# EAGLE design Current measurement circuit (EAGLE 9.6.2)
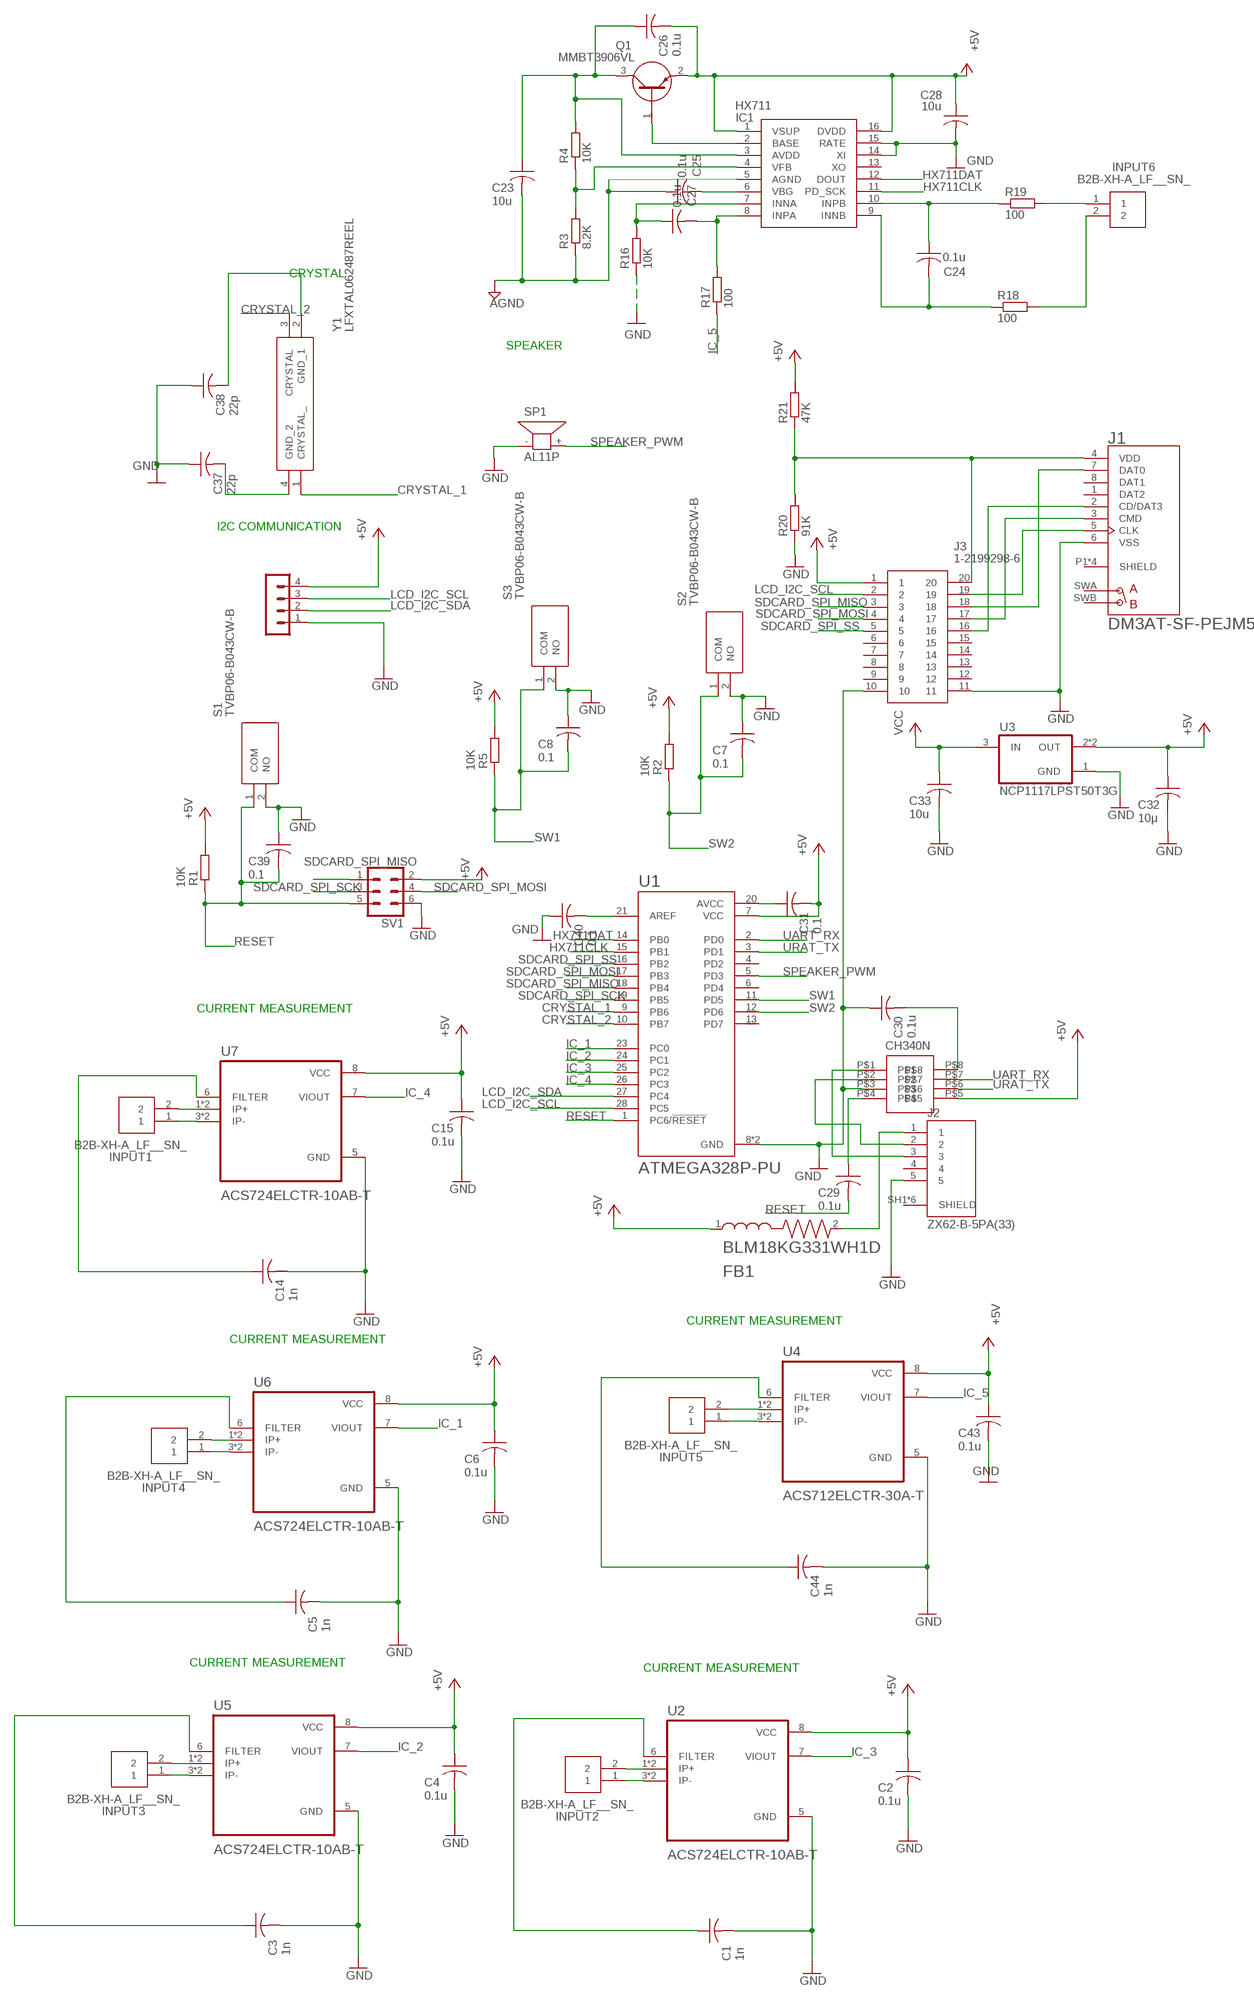
[diagram p0: schematic, sheet 1]

## Parts
C1  1n  C-USC1608  [C1608]
C2  0.1u  C-USC1608  [C1608]
C3  1n  C-USC1608  [C1608]
C4  0.1u  C-USC1608  [C1608]
C5  1n  C-USC1608  [C1608]
C6  0.1u  C-USC1608  [C1608]
C7  0.1  C-USC1608  [C1608]
C8  0.1  C-USC1608  [C1608]
C14  1n  C-USC1608  [C1608]
C15  0.1u  C-USC1608  [C1608]
C23  10u  C-USC1608  [C1608]
C24  0.1u  C-USC1608  [C1608]
C25  0.1u  C-USC1608  [C1608]
C26  0.1u  C-USC1608  [C1608]
C27  0.1u  C-USC1608  [C1608]
C28  10u  C-USC1608  [C1608]
C29  0.1u  C-USC1608  [C1608]
C30  0.1u  C-USC1608  [C1608]
C31  0.1  C-USC1608  [C1608]
C32  10μ  C-USC1608  [C1608]
C33  10u  C-USC1608  [C1608]
C37  22p  C-USC1608  [C1608]
C38  22p  C-USC1608  [C1608]
C39  0.1  C-USC1608  [C1608]
C40  0.1  C-USC1608  [C1608]
C43  0.1u  C-USC1608  [C1608]
C44  1n  C-USC1608  [C1608]
FB1  BLM18KG331WH1D  [BEADC1608X75N]
IC1  HX711  [SOIC127P600X160-16N]
INPUT1  B2B-XH-A_LF__SN_  [SHDR2W64P0X250_1X2_740X575X700]
INPUT2  B2B-XH-A_LF__SN_  [SHDR2W64P0X250_1X2_740X575X700]
INPUT3  B2B-XH-A_LF__SN_  [SHDR2W64P0X250_1X2_740X575X700]
INPUT4  B2B-XH-A_LF__SN_  [SHDR2W64P0X250_1X2_740X575X700]
INPUT5  B2B-XH-A_LF__SN_  [SHDR2W64P0X250_1X2_740X575X700]
INPUT6  B2B-XH-A_LF__SN_  [SHDR2W64P0X250_1X2_740X575X700]
J1  DM3AT-SF-PEJM5  [HRS_DM3AT-SF-PEJM5]
J2  ZX62-B-5PA(33)  [HRS_ZX62-B-5PA(33)]
J3  1-2199298-6  [DIPS762W70P254L2540H510Q20N]
Q1  MMBT3906VL  [SOT95P230X110-3N]
R1  10K  R-EU_R0603  [R0603]
R2  10K  R-EU_R0603  [R0603]
R3  8.2K  R-EU_R0603  [R0603]
R4  10K  R-EU_R0603  [R0603]
R5  10K  R-EU_R0603  [R0603]
R16  10K  R-EU_R0603  [R0603]
R17  100  R-EU_R0603  [R0603]
R18  100  R-EU_R0603  [R0603]
R19  100  R-EU_R0603  [R0603]
R20  91K  R-EU_R0603  [R0603]
R21  47K  R-EU_R0603  [R0603]
S1  TVBP06-B043CW-B  [TVBP06B043CWB]
S2  TVBP06-B043CW-B  [TVBP06B043CWB]
S3  TVBP06-B043CW-B  [TVBP06B043CWB]
SP1  AL11P  [AL11P]
SV1  MA03-2  [MA03-2]
SV4  MA04-1  [MA04-1]
U1  ATMEGA328P-PU  [DIP794W46P254L2967H457Q28B]
U2  ACS724ELCTR-10AB-T  [SOIC127P600X175-8N]
U3  NCP1117LPST50T3G  [SOT230P700X180-4N]
U4  ACS712ELCTR-30A-T  [SOIC127P600X175-8N]
U5  ACS724ELCTR-10AB-T  [SOIC127P600X175-8N]
U6  ACS724ELCTR-10AB-T  [SOIC127P600X175-8N]
U7  ACS724ELCTR-10AB-T  [SOIC127P600X175-8N]
U$1  CH340N  [CH340N]
Y1  LFXTAL062487REEL  [LFXTAL062487REEL]

## Nets
+5V [PW]: C2.1 C4.1 C6.1 C15.1 C26.2 C28.1 C31.2 C32.1 C43.1 FB1.1 IC1.1(VSUP) IC1.16(DVDD) J3.1 Q1.2(E) R1.2 R2.2 R5.2 R21.2 SV1.2 SV4.4 U1.7(VCC) U2.8(VCC) U3.2(OUT) U3.4(OUT) U4.8(VCC) U5.8(VCC) U6.8(VCC) U7.8(VCC) U$1.P$5
AGND [GND]: C23.2 C25.1 IC1.5(AGND) R3.1
CRYSTAL_1: U1.9(PB6) Y1.1(CRYSTAL_)
CRYSTAL_2: U1.10(PB7) Y1.3(CRYSTAL)
GND [GND]: C1.2 C2.2 C3.2 C4.2 C5.2 C6.2 C7.1 C8.1 C14.2 C15.2 C28.2 C30.1 C32.2 C33.2 C37.1 C38.1 C39.1 C40.1 C43.2 C44.2 IC1.14(XI) IC1.15(RATE) J1.6(VSS) J2.5 J3.10 J3.11 R16.1 R20.1 S1.2(NO) S2.2(NO) S3.2(NO) SP1.- SV1.6 SV4.1 U1.8(GND) U1.22(GND) U2.5(GND) U3.1(GND) U4.5(GND) U5.5(GND) U6.5(GND) U7.5(GND) U$1.P$3
HX711CLK: IC1.11(PD_SCK) U1.15(PB1)
HX711DAT: IC1.12(DOUT) U1.14(PB0)
IC_1: U1.23(PC0) U6.7(VIOUT)
IC_2: U1.24(PC1) U5.7(VIOUT)
IC_3: U1.25(PC2) U2.7(VIOUT)
IC_4: U1.26(PC3) U7.7(VIOUT)
IC_5: R17.1 U4.7(VIOUT)
LCD_I2C_SCL: J3.2 SV4.3 U1.28(PC5)
LCD_I2C_SDA: SV4.2 U1.27(PC4)
N$1: C29.1 U$1.P$4
N$2: C37.2 Y1.4(GND_2)
N$3: C38.2 Y1.2(GND_1)
N$4: C1.1 U2.6(FILTER)
N$5: C3.1 U5.6(FILTER)
N$7: C40.2 U1.21(AREF)
N$8: C31.1 U1.20(AVCC)
N$9 [Deta]: INPUT5.2 U4.1(IP+) U4.2(IP+)
N$10 [Deta]: INPUT5.1 U4.3(IP-) U4.4(IP-)
N$11: C44.1 U4.6(FILTER)
N$12 [Deta]: INPUT2.2 U2.1(IP+) U2.2(IP+)
N$13 [Deta]: INPUT2.1 U2.3(IP-) U2.4(IP-)
N$14: C5.1 U6.6(FILTER)
N$17 [Deta]: INPUT3.2 U5.1(IP+) U5.2(IP+)
N$18 [Deta]: INPUT3.1 U5.3(IP-) U5.4(IP-)
N$20 [Deta]: INPUT1.2 U7.1(IP+) U7.2(IP+)
N$21 [Deta]: INPUT1.1 U7.3(IP-) U7.4(IP-)
N$22: C14.1 U7.6(FILTER)
N$23: C27.1 IC1.7(INNA) R16.2
N$24: C27.2 IC1.8(INPA) R17.2
N$25: IC1.2(BASE) Q1.1(B)
N$26: C25.2 IC1.6(VBG)
N$27: C23.1 C26.1 IC1.3(AVDD) Q1.3(C) R4.2
N$29: INPUT6.1 R19.2
N$30: J1.2(CD/DAT3) J3.16
N$32: J1.3(CMD) J3.17
N$33: J1.5(CLK) J3.19
N$34: IC1.4(VFB) R3.2 R4.1
N$35: J1.7(DAT0) J3.18
N$36: J2.3 U$1.P$1
N$37: C24.1 IC1.10(INPB) R19.1
N$38: C30.2 U$1.P$8
N$39: INPUT6.2 R18.2
N$40: C24.2 IC1.9(INNB) R18.1
N$42: J2.2 U$1.P$2
N$44: FB1.2 J2.1
N$45: J1.4(VDD) J3.20 R20.2 R21.1
N$50 [Deta]: INPUT4.2 U6.1(IP+) U6.2(IP+)
N$51 [Deta]: INPUT4.1 U6.3(IP-) U6.4(IP-)
RESET: C29.2 C39.2 R1.1 S1.1(COM) SV1.5 U1.1(PC6/!RESET)
SDCARD_SPI_MISO: J3.3 SV1.1 U1.18(PB4)
SDCARD_SPI_MOSI: J3.4 SV1.4 U1.17(PB3)
SDCARD_SPI_SCK: SV1.3 U1.19(PB5)
SDCARD_SPI_SS: J3.5 U1.16(PB2)
SPEAKER_PWM: SP1.+ U1.5(PD3)
SW1: C8.2 R5.1 S3.1(COM) U1.11(PD5)
SW2: C7.2 R2.1 S2.1(COM) U1.12(PD6)
UART_RX: U1.2(PD0) U$1.P$7
URAT_TX: U1.3(PD1) U$1.P$6
VCC [PW]: C33.1 U3.3(IN)
Unconnected: IC1.13(XO) J1.1(DAT2) J1.8(DAT1) J1.P1(SHIELD) J1.P2(SHIELD) J1.P3(SHIELD) J1.P4(SHIELD) J1.SWA(A) J1.SWB(B) J2.4 J2.SH1(SHIELD) J2.SH2(SHIELD) J2.SH3(SHIELD) J2.SH4(SHIELD) J2.SH5(SHIELD) J2.SH6(SHIELD) J3.6 J3.7 J3.8 J3.9 J3.12 J3.13 J3.14 J3.15 U1.4(PD2) U1.6(PD4) U1.13(PD7)

## Notes on the sheet
- CRYSTAL
- SPEAKER
- I2C COMMUNICATION
- CURRENT MEASUREMENT
- CURRENT MEASUREMENT
- CURRENT MEASUREMENT
- CURRENT MEASUREMENT
- CURRENT MEASUREMENT

## Library data of the parts
C1-C8 C14 C15 C23-C33 C37-C40 C43 C44 = rcl:C-US: CAPACITOR, American symbol; SPICEPREFIX: C
FB1 = BLM18KG331WH1D:BLM18KG331WH1D: 100 Ohms @ 100MHz 1 Power Line Ferrite Bead 0603 (1608 Metric) 1.5A 55mOhm Check prices <https://pricing.snapeda.com/parts/BLM18KG331WH1D/Murata/view-part?ref=eda>; AVAILABILITY: In Stock; DESCRIPTION: 330 Ohms @ 100MHz 1 Power Line Ferrite Bead 0603 (1608 Metric) 1.25A 110mOhm; MF: Murata; MP: BLM18KG331WH1D; PACKAGE: 0603 Murata; PRICE: None; PURCHASE-URL: https://pricing.snapeda.com/search/part/BLM18KG331WH1D/?ref=eda
IC1 = SamacSys_Parts:HX711: 24-Bit Analog-to-Digital Converter (ADC) for Weigh Scales Source: Datasheet <https://cdn.sparkfun.com/datasheets/Sensors/ForceFlex/hx711_english.pdf>; DESCRIPTION: 24-Bit Analog-to-Digital Converter (ADC) for Weigh Scales; HEIGHT: 1.6mm; MANUFACTURER_NAME: DFRobot; MANUFACTURER_PART_NUMBER: HX711
INPUT1-INPUT6 = SamacSys_Parts:B2B-XH-A_LF__SN_: Connector Header Through Hole 2 position 0.098" (2.50mm) Source: Datasheet <http://www.jst-mfg.com/product/pdf/eng/eXH.pdf>; DESCRIPTION: Connector Header Through Hole 2 position 0.098" (2.50mm); HEIGHT: 7mm; MANUFACTURER_NAME: JST (JAPAN SOLDERLESS TERMINALS); MANUFACTURER_PART_NUMBER: B2B-XH-A(LF)(SN)
J1 = DM3AT-SF-PEJM5:DM3AT-SF-PEJM5: DM3 Series 8 Position Right Angle SMT Push Push Ejection MicroSD Card Connector Check prices <https://pricing.snapeda.com/parts/DM3AT-SF-PEJM5/Hirose/view-part?ref=eda>; AVAILABILITY: In Stock; DESCRIPTION: 10 (8 + 2) Position Card Connector Secure Digital - microSD™ Surface Mount, Right Angle Gold; MF: Hirose; MP: DM3AT-SF-PEJM5; PACKAGE: None; PRICE: None; PURCHASE-URL: https://pricing.snapeda.com/search/part/DM3AT-SF-PEJM5/?ref=eda
J2 = ZX62-B-5PA_33_:ZX62-B-5PA(33): ZX Series 5 Position Right Angle PCB Wire Micro B USB Plug Check prices <https://pricing.snapeda.com/parts/ZX62-B-5PA%2833%29/Hirose/view-part?ref=eda>; AVAILABILITY: In Stock; DESCRIPTION: USB - micro B USB 2.0 Receptacle Connector 5 Position Surface Mount, Right Angle; MF: Hirose; MP: ZX62-B-5PA(33); PACKAGE: None; PRICE: None; PURCHASE-URL: https://pricing.snapeda.com/search/part/ZX62-B-5PA(33)/?ref=eda
J3 = SamacSys_Parts:1-2199298-6: TE Connectivity 2.54mm Pitch Straight 20 Way, Through Hole Ladder IC Dip Socket, 1A Source: Datasheet <https://www.te.com/commerce/DocumentDelivery/DDEController?Action=showdoc&DocId=Customer Drawing2199298ApdfEnglishENG_CD_2199298_A_baseFilename.pdf1-2199298-6>; DESCRIPTION: TE Connectivity 2.54mm Pitch Straight 20 Way, Through Hole Ladder IC Dip Socket, 1A; HEIGHT: 5.1mm; MANUFACTURER_NAME: TE Connectivity; MANUFACTURER_PART_NUMBER: 1-2199298-6; MOUSER_PART_NUMBER: 571-1-2199298-6; MOUSER_PRICE-STOCK: https://www.mouser.co.uk/ProductDetail/TE-Connectivity/1-2199298-6?qs=fK8dlpkaUMvuMXpJTs4GlA%3D%3D
Q1 = SamacSys_Parts:MMBT3906VL: MMBT3906 - PNP switching transistor Source: Datasheet <http://assets.nexperia.com/documents/data-sheet/MMBT3906.pdf>; DESCRIPTION: MMBT3906 - PNP switching transistor; HEIGHT: 1.1mm; MANUFACTURER_NAME: Nexperia; MANUFACTURER_PART_NUMBER: MMBT3906VL; MOUSER_PART_NUMBER: 771-MMBT3906VL; MOUSER_PRICE-STOCK: https://www.mouser.co.uk/ProductDetail/Nexperia/MMBT3906VL?qs=cnAQGvEIVkImZI4SlBypMg%3D%3D
R1-R5 R16-R21 = rcl:R-EU_: RESISTOR, European symbol; SPICEPREFIX: R
S1-S3 = SamacSys_Parts:TVBP06-B043CW-B: Tactile Switch Source: Datasheet <http://akizukidenshi.com/download/ds/jianfu/TVBP06-BN043CW-B.pdf>; DESCRIPTION: Tactile Switch; HEIGHT: 4.4mm; MANUFACTURER_NAME: Zhejiang Jianfu Electronics Co., Ltd; MANUFACTURER_PART_NUMBER: TVBP06-B043CW-B
SP1 = buzzer:AL11P: SPEAKER Source: Buerklin; OC_FARNELL: unknown; OC_NEWARK: unknown
SV1 = con-lstb:MA03-2: PIN HEADER; OC_FARNELL: unknown; OC_NEWARK: unknown
SV4 = con-lstb:MA04-1: PIN HEADER; OC_FARNELL: unknown; OC_NEWARK: unknown
U1 = ATMEGA328P-PU:ATMEGA328P-PU: ATmega Series 20 MHz 32 KB Flash 2 KB SRAM 8-Bit Microcontroller - DIP-28 Check prices <https://pricing.snapeda.com/parts/ATMEGA328P-PU/Microchip%20Technology/view-part?ref=eda>; AVAILABILITY: In Stock; DESCRIPTION: AVR AVR® ATmega Microcontroller IC 8-Bit 20MHz 32KB (16K x 16) FLASH 28-PDIP; MF: Microchip Technology; MP: ATMEGA328P-PU; PACKAGE: DIP-28 Microchip Technology; PRICE: None; PURCHASE-URL: https://pricing.snapeda.com/search/part/ATMEGA328P-PU/?ref=eda
U2 U5-U7 = ACS724ELCTR-10AB-T:ACS724ELCTR-10AB-T: Check prices <https://pricing.snapeda.com/parts/ACS712ELCTR-05B-T/Allegro/view-part?ref=eda>; AVAILABILITY: In Stock; DESCRIPTION: Current Sensor 5A 1 Channel Hall Effect, Open Loop Bidirectional 8-SOIC (0.154, 3.90mm Width); MF: Allegro; MP: ACS712ELCTR-05B-T; PACKAGE: SOIC-8 Allegro MicroSystems LLC; PRICE: None
U3 = NCP1117LPST50T3G:NCP1117LPST50T3G: Linear Voltage Regulator, Positive, LDO, 1.0 A (Fixed and Adjustable) Vout: 5.0 V Check prices <https://pricing.snapeda.com/parts/NCP1117LPST50T3G/ON%20Semiconductor/view-part?ref=eda>; AVAILABILITY: In Stock; DESCRIPTION: Linear Voltage Regulator IC Positive Fixed 1 Output 1A SOT-223; MF: ON Semiconductor; MP: NCP1117LPST50T3G; PACKAGE: SOT-223-4 ON Semiconductor; PRICE: None; PURCHASE-URL: https://pricing.snapeda.com/search/part/NCP1117LPST50T3G/?ref=eda
U4 = ACS712ELCTR-30A-T:ACS712ELCTR-30A-T: Check prices <https://pricing.snapeda.com/parts/ACS712ELCTR-05B-T/Allegro/view-part?ref=eda>; AVAILABILITY: In Stock; DESCRIPTION: Current Sensor 5A 1 Channel Hall Effect, Open Loop Bidirectional 8-SOIC (0.154, 3.90mm Width); MF: Allegro; MP: ACS712ELCTR-05B-T; PACKAGE: SOIC-8 Allegro MicroSystems LLC; PRICE: None
U$1 = CH340N:CH340N
Y1 = LFXTAL062487Reel:LFXTAL062487REEL: Crystals 16MHz 22pF -10C 60C Source: Datasheet <https://www.iqdfrequencyproducts.com/products/pn/LFXTAL062487Reel.pdf>; DESCRIPTION: Crystals 16MHz 22pF -10C 60C; HEIGHT: 0.6mm; MANUFACTURER_NAME: IQD; MANUFACTURER_PART_NUMBER: LFXTAL062487Reel; MOUSER_PART_NUMBER: 449-LFXTAL062487REEL; MOUSER_PRICE-STOCK: https://www.mouser.co.uk/ProductDetail/IQD/LFXTAL062487Reel?qs=e4%2FAndAAwgKTrG0QMc3CnQ%3D%3D

## Net classes
0 default: width 0.203 mm
1 PW: width 0.508 mm
2 GND: width 0.381 mm
3 Deta: width 2.54 mm

## Board
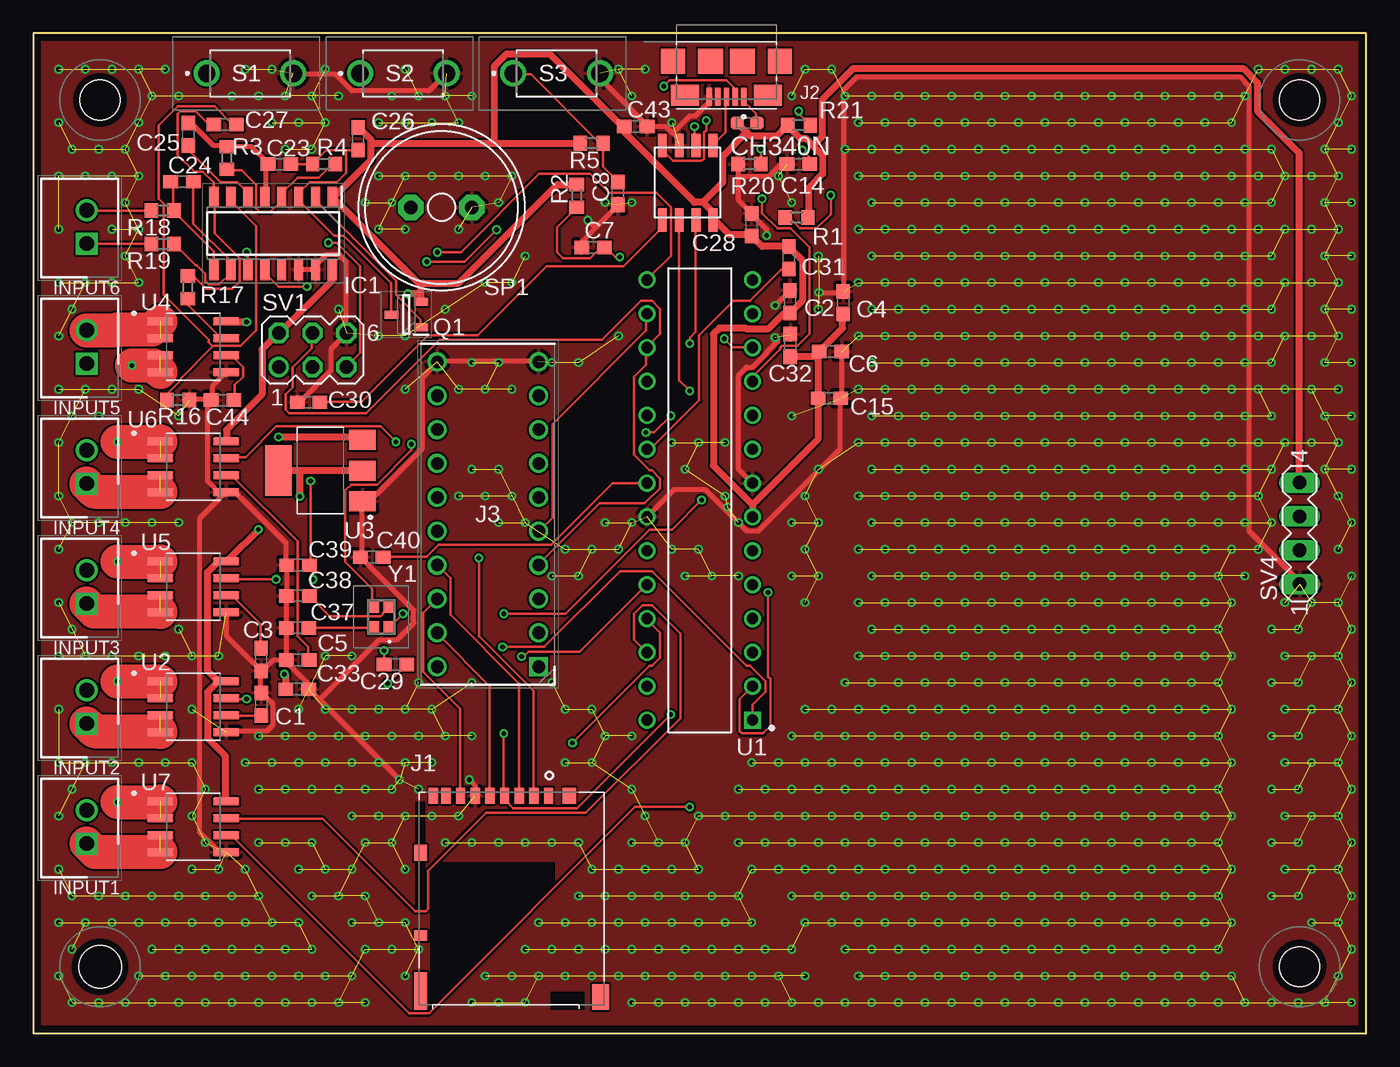
[diagram p1: board, top side]
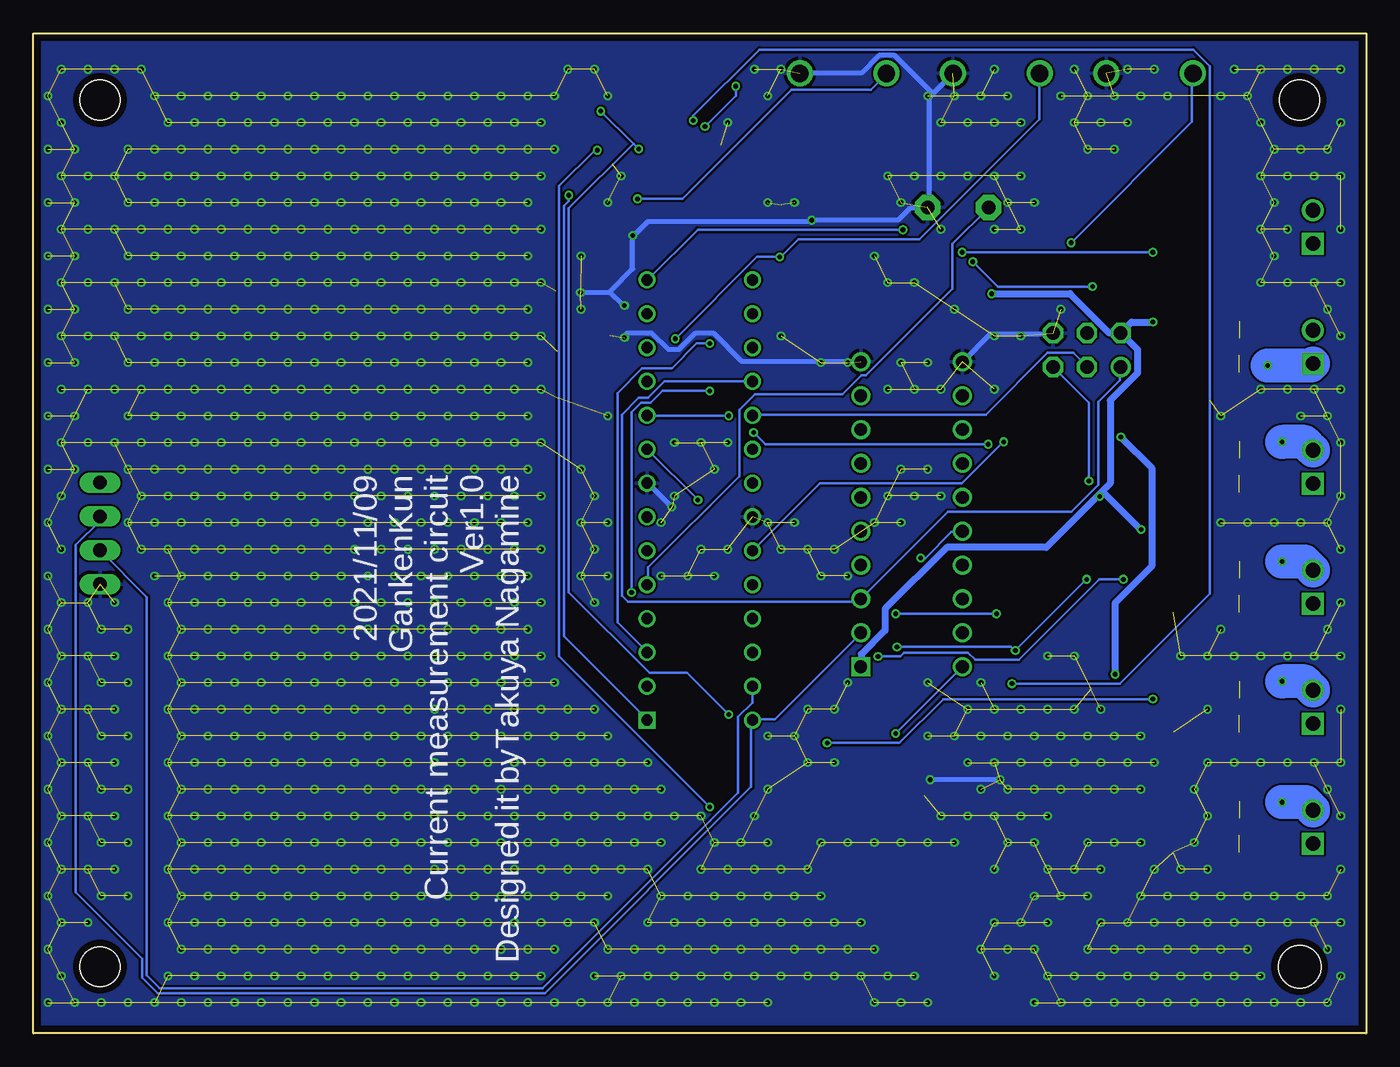
[diagram p2: board, bottom side, seen from below]

Size 100 x 75 mm. Coordinates in mm from the lower left corner, seen from the top.
Outline: 0,0 100,0 100,75 0,75 0,0
Copper layers (1*16): Top 0.035mm / dielectric 1.6mm / Bottom 0.035mm
Design rules "Elecrow_2-layer_PCB_eagle_rule": minimum track width 6mil, minimum drill 12mil, track to track 6mil, track to pad 6mil, pad to pad 6mil, via to via 8mil, smd to smd 0mil, copper to edge 20mil, drill to drill 10mil, minimum pad ring 6mil, minimum via ring 6mil, stop-mask expansion 0mil, vias tented up to drill 100mil, thermal gap 10mil
Holes 3.2 mm at 5,5
Holes 3 mm at 95,5 95,70 5,70

### Footprints (pad centres in the part's own frame; a part is rotated, then mirrored left to right if it is on the bottom)
C1608 = smd 1.1 x 1: 1 -0.85,0; 2 0.85,0
BEADC1608X75N = smd 1 x 0.97: 1 -0.735,0; 2 0.735,0
SOIC127P600X160-16N = smd 1.55 x 0.7: 1 -2.725,4.445; 2 -2.725,3.175; 3 -2.725,1.905; 4 -2.725,0.635; 5 -2.725,-0.635; 6 -2.725,-1.905; 7 -2.725,-3.175; 8 -2.725,-4.445; 9 2.725,-4.445; 10 2.725,-3.175; 11 2.725,-1.905; 12 2.725,-0.635; 13 2.725,0.635; 14 2.725,1.905; 15 2.725,3.175; 16 2.725,4.445
SHDR2W64P0X250_1X2_740X575X700 = drill 1.1 pad 1.65 square: 1 -1.27,0 | drill 1.1 pad 1.65: 2 1.23,0
HRS_DM3AT-SF-PEJM5 = smd 0.7 x 1.2: 1 3.2,0; 2 2.1,0; 3 1,0; 4 -0.1,0; 5 -1.2,0; 6 -2.3,0; 7 -3.4,0; 8 -4.5,0; SWB -5.45,0 | smd 1 x 1.2: P1 -6.4,-4.3; P4 4.75,0 | smd 1 x 2.8: P2 -6.4,-14.65 | smd 1.3 x 1.9: P3 7.1,-15.1 | smd 1 x 0.8: SWA -6.4,-10.5
HRS_ZX62-B-5PA(33) = smd 0.4 x 1.35: 1 -1.3,2.675; 2 -0.65,2.675; 3 0,2.675; 4 0.65,2.675; 5 1.3,2.675 | smd 2.1 x 1.6: SH1 -3.1,2.55; SH6 3.1,2.55 | smd 1.8 x 1.9: SH2 -4,0; SH5 4,0 | smd 1.9 x 1.9: SH3 -1.2,0; SH4 1.2,0
DIPS762W70P254L2540H510Q20N = drill 0.95 pad 1.425 square: 1 0,0 | drill 0.95 pad 1.425: 2 0,-2.54; 3 0,-5.08; 4 0,-7.62; 5 0,-10.16; 6 0,-12.7; 7 0,-15.24; 8 0,-17.78; 9 0,-20.32; 10 0,-22.86; 11 7.62,-22.86; 12 7.62,-20.32; 13 7.62,-17.78; 14 7.62,-15.24; 15 7.62,-12.7; 16 7.62,-10.16; 17 7.62,-7.62; 18 7.62,-5.08; 19 7.62,-2.54; 20 7.62,0
SOT95P230X110-3N = smd 1.05 x 0.6: 1 -1.1,0.95; 2 -1.1,-0.95; 3 1.1,0
R0603 = smd 1 x 1.1: 1 -0.85,0; 2 0.85,0
TVBP06B043CWB = drill 1.3 pad 1.95: 1 0,0; 2 6.5,0
AL11P = drill 1.016 pad 1.905 octagon: + 2.286,0; - -2.286,0
MA03-2 = drill 1.016: 1 -2.54,-1.27 | drill 1.016 octagon: 2 -2.54,1.27; 3 0,-1.27; 4 0,1.27; 5 2.54,-1.27; 6 2.54,1.27
MA04-1 = drill 1.016 long: 1 -3.81,0; 2 -1.27,0; 3 1.27,0; 4 3.81,0
DIP794W46P254L2967H457Q28B = drill 0.85 square: 1 -3.96,16.51 | drill 0.85: 2 -3.96,13.97; 3 -3.96,11.43; 4 -3.96,8.89; 5 -3.96,6.35; 6 -3.96,3.81; 7 -3.96,1.27; 8 -3.96,-1.27; 9 -3.96,-3.81; 10 -3.96,-6.35; 11 -3.96,-8.89; 12 -3.96,-11.43; 13 -3.96,-13.97; 14 -3.96,-16.51; 15 3.96,-16.51; 16 3.96,-13.97; 17 3.96,-11.43; 18 3.96,-8.89; 19 3.96,-6.35; 20 3.96,-3.81; 21 3.96,-1.27; 22 3.96,1.27; 23 3.96,3.81; 24 3.96,6.35; 25 3.96,8.89; 26 3.96,11.43; 27 3.96,13.97; 28 3.96,16.51
SOIC127P600X175-8N = smd 1.97 x 0.6: 1 -2.475,1.905; 2 -2.475,0.635; 3 -2.475,-0.635; 4 -2.475,-1.905; 5 2.475,-1.905; 6 2.475,-0.635; 7 2.475,0.635; 8 2.475,1.905
SOT230P700X180-4N = smd 2 x 1.5: 1 -3.15,2.3; 2 -3.15,0; 3 -3.15,-2.3 | smd 2 x 3.8: 4 3.15,0
CH340N = smd 0.65 x 1.75: P$1 0,0; P$2 1.27,0; P$3 2.54,0; P$4 3.81,0; P$5 0,5.6; P$6 1.27,5.6; P$7 2.54,5.6; P$8 3.81,5.6
LFXTAL062487REEL = smd 1 x 0.9: 1 -0.825,-0.613; 2 0.825,-0.613; 3 0.825,0.613; 4 -0.825,0.613

### Placement (x,y rotation side)
C1  17.11,24.68 90 top
C2  56.77,54.87 90 top
C3  17.09,28.03 270 top
C4  60.77,54.79 90 top
C5  19.84,28.01 180 top
C6  59.81,51.13 0 top
C7  41.99,58.94 0 top
C8  43.86,62.99 90 top
C14  57.39,65.19 180 top
C15  59.73,47.63 0 top
C23  18.47,65.19 180 top
C24  11.15,63.87 180 top
C25  11.63,67.43 270 top
C26  24.37,67.09 90 top
C27  14.39,68.17 180 top
C28  53.89,60.65 90 top
C29  27.17,27.67 180 top
C30  20.65,47.33 0 top
C31  56.69,58.17 90 top
C32  56.79,51.59 90 top
C33  19.81,25.81 0 top
C37  19.83,30.41 0 top
C38  19.85,32.81 0 top
C39  19.87,35.11 0 top
C40  25.39,35.71 0 top
C43  45.19,68.01 0 top
C44  14.19,47.49 180 top
FB1  53.55,68.27 0 top
IC1  18,60 270 top
INPUT1  4,15.5 90 top
INPUT2  4,24.5 90 top
INPUT3  4,33.5 90 top
INPUT4  4,42.5 90 top
INPUT5  4,51.5 90 top
INPUT6  4,60.5 90 top
J1  35.46,17.83 0 top
J2  52,72.9 180 top
J3  37.92,27.5 180 top
Q1  27.98,53.91 180 top
R1  57.27,61.19 0 top
R2  40.76,62.81 90 top
R3  14.53,65.65 270 top
R4  21.81,65.21 180 top
R5  41.89,66.76 180 top
R16  10.87,47.49 180 top
R17  11.59,55.95 90 top
R18  9.71,61.71 180 top
R19  9.7,59.21 180 top
R20  53.73,65.19 0 top
R21  57.45,68.11 180 top
S1  13,72 0 top
S2  24.5,72 0 top
S3  36,72 0 top
SP1  30.62,61.95 180 top
SV1  20.95,51.25 0 top
SV4  95,37.5 90 top
U1  50,40 180 top
U2  12,24.5 0 top
U3  21.54,42.21 180 top
U4  12,51.5 0 top
U5  12,33.5 0 top
U6  12,42.5 0 top
U7  12,15.5 0 top
U$1  50.99,66.6 180 top
Y1  26.11,31.23 90 top

### Tracks (layer width: path | path; a pad name or v marks a point on that pad's centre or on a via)
+5V  (via drill 0.35)
  Top 0.508: 53.52,67.56 53.78,67.3 55.74,67.3 56.54,68.1 R21.2 56.72,67.92 57.52,67.12 57.96,67.12 58.5,66.59 | 53.52,67.56 52.9,68.19 FB1.1 | 58.5,66.59 59.21,65.88 59.21,64.45 58.14,63.39 58.14,61.25 R1.2 | 58.5,66.59 59.21,67.3 59.21,70.05 61.52,72.36 90.77,72.36 91.83,71.3 91.83,69.16 94.94,66.05 94.94,41.34 SV4.4 | U7.8 14.4,17.42 14.4,20.8 13.07,22.14 13.07,25.6 13.87,26.4 14.4,26.4 U2.8 13.69,26.58 13.07,27.2 13.07,34.58 13.87,35.38 14.4,35.38 U5.8 14.67,35.56 v16.89,37.78 | 20,42.23 18.4,42.23 U3.4 | 20,42.23 24.62,42.23 U3.2 | IC1.16 22.4,57.25 22.4,56.45 18.49,52.54 SV1.2 18.22,52.36 17.16,51.3 17.16,47.92 14.49,45.25 14.49,44.45 U6.8 | v16,53.34 14.49,53.34 U4.8 | v20,40.27 20,42.23 | 29.07,56.1 29.07,55.47 | 29.07,55.47 29.07,54.94 Q1.2 | 29.07,56.1 22.49,62.67 IC1.1 22.67,62.85 25.34,65.52 25.34,66.76 | R2.2 40.72,63.65 39.29,63.65 31.91,56.27 29.25,56.27 29.07,56.1 | 25.34,66.76 25.34,67.03 24.45,67.92 C26.2 | 25.34,66.76 34.58,66.76 | 34.58,66.76 40.98,66.76 R5.2 | C32.1 56.81,50.76 58.59,50.76 58.94,51.12 C6.1 | C6.1 58.85,50.67 58.85,47.65 C15.1 58.85,47.38 58.85,44.54 53.96,39.65 | C4.1 60.72,53.87 60.72,52.9 59.12,51.3 C6.1 | 53.96,39.65 53.96,38.76 U1.7 | 50.23,62.32 49.61,62.32 44.36,67.56 44.36,68.01 C43.1 44.09,68.1 38.76,73.43 35.47,73.43 34.58,72.54 34.58,66.76 | 50.23,62.32 50.94,61.61 50.94,61.07 U$1.P$5 51.21,60.9 52.18,59.92 53.7,59.92 C28.1 53.96,59.74 54.67,59.03 56.63,59.03 C31.2 56.81,58.85 57.7,57.96 57.7,54.94 56.81,54.05 C2.1 56.54,53.96 56.27,53.96 55.12,52.81 53.52,52.81 53.43,52.9 51.47,52.9 51.03,52.45 51.03,42.58 53.96,39.65
  Top 0.508: 29.07,55.47 v28.09,55.47 | 53.52,67.56 51.74,65.79 51.74,63.83 50.23,62.32
  Bottom 0.508: v16,53.34 17.6,53.34 18.4,52.54 SV1.2 | 19.78,40.67 19.2,41.25 19.2,47.47 17.16,49.52 17.16,51.3 18.22,52.36 SV1.2 | 19.78,40.67 20.09,40.36 | 20.09,40.36 24,36.45 31.47,36.45 36.09,31.83 36.09,30.23 37.87,28.45 37.87,27.56 J3.1 | v20,40.27 20.09,40.36 | 19.78,40.67 v16.89,37.78 | v28.09,55.47 22.23,55.47 19.29,52.54 18.67,52.54 SV1.2
AGND
  Top 0.381: C25.1 11.65,68.28 11.82,68.28 13.51,66.59 14.4,66.59 R3.1 14.58,66.5 16.36,66.5 17.6,65.25 C23.2 17.42,65.16 17.42,62.76 IC1.5
CRYSTAL_1  (via drill 0.35)
  Top 0.203: v27.74,31.47 26.76,30.49 Y1.1 | v35.29,31.47 39.92,31.47 46.23,37.78 47.92,37.78 v50.14,40.01
  Bottom 0.203: v35.29,31.47 v27.74,31.47 | v50.14,40.01 53.87,43.74 U1.9
CRYSTAL_2  (via drill 0.35)
  Top 0.203: v28.36,44.18 28.36,43.74 25.78,41.16 23.82,41.16 23.38,40.72 23.38,35.38 25.43,33.34 25.43,32.09 Y1.3 | v45.96,45.07 46.58,45.07 v47.83,46.32
  Bottom 0.203: v28.36,44.18 45.07,44.18 v45.96,45.07 | v47.83,46.32 53.87,46.32 U1.10
GND  (via drill 0.35)  (1007 unrouted)
  Top 0.381: IC1.14 19.91,57.25 21.16,57.25 IC1.15 21.25,57.43 21.25,57.7 21.96,58.41 22.94,58.41 23.47,57.87 23.47,52.72 SV1.6 23.47,52.45 22.31,51.3 22.31,49.7 20,47.38 19.82,47.38 C30.1 | J3.10 37.87,50.41 30.32,50.41 J3.11 30.23,50.23 29.16,49.16 29.16,43.83 25.34,40.01 24.8,40.01 U3.1 24.62,39.83 24.62,35.74 C40.1 24.71,35.56 28.54,31.74 28.54,30.76 27.29,29.52 25.96,29.52 21.47,25.02 | C3.2 17.07,27.11 17.07,25.6 C1.2 17.25,25.43 17.96,24.71 17.96,23.11 17.51,22.67 14.49,22.67 U2.5 | C5.2 18.94,28 18.05,28 17.25,27.2 C3.2 | C5.2 19.02,28.18 19.02,30.4 C37.1 19.02,30.58 19.02,32.63 C38.1 19.02,32.89 19.02,35.03 C39.1 18.94,35.29 18.94,36.8 15.11,40.63 14.67,40.63 U6.5 | C5.2 19.02,27.83 20.62,26.23 20.62,25.87 C33.2 20.8,25.69 21.47,25.02 | v32.72,19.02 33.16,18.58 33.16,17.87 J1.6 | 21.47,25.02 v27.47,19.02 | U5.5 14.49,31.56 14.49,29.78 16.98,27.29 C3.2 | R16.1 11.73,47.56 13.34,47.56 C44.2 | C44.2 13.42,47.74 13.42,48.54 14.4,49.52 U4.5 | U7.5 14.4,13.6 13.96,13.6 12.45,15.11 12.45,38.58 14.4,40.54 U6.5 | C44.2 13.07,47.38 13.07,41.43 14.05,40.45 U6.5 | 47.96,67.52 48.36,67.12 48.36,66.67 U$1.P$3 | 47.96,67.52 47.47,68.01 C43.2 45.96,68.19 42.58,71.56 42.58,71.92 S3.2 | 47.96,67.52 49.25,68.81 49.7,68.81 50.67,69.79 50.67,70.14 J2.5 | 42.18,60.41 43.83,62.05 C8.1 | 42.18,60.41 41.16,59.38 41.16,58.94 C7.1 | v41.6,60.98 42.18,60.41 | S1.2 19.56,71.92 22.67,71.92 23.91,70.67 29.69,70.67 30.94,71.92 S2.2 | C6.2 60.63,51.12 60.63,47.65 C15.2 60.54,47.47 60.54,43.83 54.41,37.69 53.52,37.69 51.96,39.25 | 51.96,39.25 50.41,40.8 48.09,40.8 46.05,38.76 U1.22
  Top 0.381: 52.9,64.28 52.9,62.5 53.87,61.52 C28.2 53.96,61.34 55.03,60.27 v55.03,59.83 | 52.9,64.28 52.9,65.16 R20.1 | 52.9,64.28 55.21,64.28 56.1,65.16 56.45,65.16 C14.2 | 56.72,52.36 C32.2 | U1.8 53.87,41.34 52.9,42.32 52.9,49.34 53.52,49.96 53.96,49.96 55.03,51.03 55.03,51.12 55.87,51.96 v55.65,52.18 | v55.65,54.59 56.72,55.65 C2.2 | v58.94,55.56 60.72,55.56 C4.2 60.81,55.83 60.81,70.76 61.78,71.74 90.5,71.74 91.21,71.03 91.21,37.69 94.94,33.96 94.94,33.69 SV4.1 | v52.09,39.47 52.09,39.38 51.96,39.25
  Bottom 0.381: SV1.6 23.56,52.45 28.18,52.45 30.23,50.41 J3.11 | v27.47,19.02 v32.72,19.02 | 32.49,70.45 31.03,71.92 S2.2 | 32.49,70.45 32.8,70.14 32.8,62.05 SP1.- 32.98,61.87 34.23,61.87 35.12,60.98 v41.6,60.98 41.78,60.9 53.87,60.9 54.85,59.92 v55.03,59.83 55.03,57.34 56.63,55.74 56.72,55.56 | 32.49,70.45 35.38,73.34 36.54,73.34 37.87,72.01 S3.2 | 56.72,55.56 v58.94,55.56 | 56.72,55.56 55.83,54.67 v55.65,54.59 | v52.09,39.47 53.87,41.25 U1.8 | J3.10 37.96,50.41 46.85,50.41 48.98,52.54 50.32,52.54 51.56,51.3 52.36,51.3 53.61,52.54 55.47,52.54 v55.65,52.18
  other vias: 2.9,2.31 1.9,4.3 2.9,6.3 1.9,8.3 2.9,10.3 1.9,12.3 1.9,16.3 2.9,18.3 1.9,20.3 1.9,24.3 1.9,28.3 2.9,30.3 1.9,32.3 1.9,36.3 2.9,38.3 1.9,40.3 1.9,44.3 2.9,46.3 1.9,48.3 1.9,52.3 2.9,54.3 1.9,56.3 1.9,60.3 1.9,64.31 2.9,66.31 1.9,68.31 1.9,72.31 4.9,2.31 3.9,8.3 4.9,10.3 3.9,20.3 3.9,28.3 4.9,38.3 4.9,46.3 3.9,48.3 3.9,56.3 3.9,64.31 4.9,66.31 3.9,72.31 6.9,2.31 5.9,8.3 6.9,10.3 5.9,20.3 5.9,28.3 6.9,38.3 5.9,48.3 5.9,56.3 6.9,58.3 5.9,60.3 6.9,62.3 5.9,64.31 6.9,66.31 5.9,72.31 8.9,2.31 7.9,4.3 8.9,6.3 7.9,8.3 8.9,10.3 7.9,20.3 7.9,28.3 8.9,38.3 7.9,48.3 7.9,56.3 7.9,60.3 7.9,64.31 7.9,68.31 8.9,70.31 7.9,72.31 10.9,2.31 9.9,4.3 10.9,6.3 9.9,8.3 10.9,10.3 9.9,20.3 9.9,28.3 10.9,30.3 10.9,38.3 10.9,46.3 10.9,70.31 9.9,72.31 12.9,2.31 11.9,4.3 12.9,6.3 11.9,8.3 12.9,10.3 11.9,12.3 12.9,14.3 11.9,16.3 12.9,18.3 11.9,20.3 11.9,24.3 11.9,28.3 14.9,2.31 13.9,4.3 14.9,6.3 13.9,8.3 14.9,10.3 13.9,12.3 13.9,28.3 14.9,70.31 16.9,2.31 15.9,4.3 16.9,6.3 15.9,8.3 16.9,10.3 15.9,12.3 16.9,14.3 16.9,18.3 15.9,20.3 16.9,22.3 16.9,70.31 15.9,72.31 18.9,2.31 17.9,4.3 18.9,6.3 17.9,8.3 18.9,14.3 18.9,18.3 17.9,20.3 18.9,22.3 18.9,66.31 17.9,68.31 18.9,70.31 17.9,72.31 20.9,2.31 19.9,4.3 20.9,6.3 19.9,8.3 20.9,10.3 19.9,12.3 20.9,14.3 20.9,18.3 19.9,20.3 20.9,22.3 19.9,24.3 20.9,66.31 19.9,68.31 20.9,70.31 22.9,2.31 21.9,4.3 22.9,10.3 21.9,12.3 22.9,18.3 21.9,20.3 22.9,22.3 21.9,24.3 21.9,28.3 22.9,54.3 21.9,68.31 22.9,70.31 21.9,72.31 24.9,2.31 23.9,4.3 24.9,6.3 23.9,8.3 24.9,10.3 23.9,12.3 24.9,14.3 23.9,16.3 24.9,18.3 23.9,20.3 24.9,22.3 23.9,24.3 23.9,28.3 24.9,62.3 26.9,6.3 25.9,8.3 26.9,14.3 25.9,16.3 26.9,18.3 25.9,20.3 26.9,22.3 25.9,24.3 25.9,52.3 25.9,60.3 26.9,62.3 25.9,64.31 25.9,68.31 26.9,70.31 27.9,4.3 28.9,6.3 27.9,8.3 27.9,12.3 27.9,16.3 28.9,18.3 27.9,20.3 28.9,22.3 27.9,24.3 28.9,26.3 27.9,48.3 27.9,52.3 27.9,60.3 27.9,64.31 27.9,68.31 28.9,70.31 27.9,72.31 30.9,14.3 29.9,16.3 29.9,20.3 30.9,22.3 29.9,24.3 30.9,54.3 29.9,64.31 29.9,68.31 30.9,70.31 32.9,2.31 32.9,14.3 31.9,16.3 32.9,22.3 32.9,26.3 31.9,40.3 32.9,42.3 31.9,48.3 32.9,50.3 31.9,60.3 31.9,64.31 31.9,68.31 32.9,70.31 34.9,2.31 33.9,4.3 34.9,14.3 34.9,38.3 33.9,40.3 34.9,42.3 33.9,48.3 34.9,50.3 33.9,56.3 34.9,62.3 33.9,64.31 36.9,2.31 35.9,4.3 36.9,6.3 36.9,14.3 36.9,38.3 35.9,40.3 35.9,48.3 35.9,56.3 36.9,58.3 35.9,64.31 37.9,4.3 38.9,6.3 37.9,8.3 38.9,14.3 38.9,26.3 38.9,34.3 38.9,50.3 39.9,4.3 40.9,6.3 39.9,8.3 40.9,10.3 40.9,14.3 39.9,20.3 39.9,24.3 40.9,34.3 39.9,36.3 40.9,50.3 41.9,4.3 42.9,6.3 41.9,8.3 42.9,10.3 41.9,12.3 41.9,20.3 42.9,22.3 41.9,24.3 41.9,36.3 42.9,38.3 42.9,62.3 44.9,2.31 43.9,4.3 44.9,6.3 43.9,8.3 44.9,10.3 43.9,12.3 44.9,14.3 44.9,18.3 44.9,22.3 43.9,36.3 44.9,38.3 43.9,52.3 44.9,62.3 44.9,70.31 43.9,72.31 46.9,2.31 45.9,4.3 46.9,6.3 45.9,8.3 46.9,10.3 45.9,12.3 46.9,14.3 45.9,16.3 45.9,72.31 48.9,2.31 47.9,4.3 48.9,6.3 47.9,8.3 48.9,10.3 47.9,12.3 48.9,14.3 48.9,34.3 47.9,36.3 48.9,42.3 47.9,44.3 47.9,68.31 50.9,2.31 49.9,4.3 50.9,6.3 49.9,8.3 50.9,10.3 49.9,12.3 49.9,16.3 50.9,34.3 49.9,36.3 49.9,44.3 52.9,2.31 51.9,4.3 52.9,6.3 51.9,8.3 52.9,10.3 52.9,14.3 51.9,16.3 52.9,18.3 52.9,34.3 52.9,38.3 51.9,40.3 51.9,44.3 54.9,2.31 53.9,4.3 54.9,6.3 53.9,8.3 53.9,12.3 54.9,14.3 53.9,16.3 54.9,18.3 53.9,20.3 56.9,2.31 55.9,4.3 56.9,6.3 56.9,10.3 55.9,12.3 56.9,14.3 55.9,16.3 56.9,18.3 55.9,20.3 56.9,22.3 56.9,34.3 56.9,38.3 56.9,46.3 56.9,62.3 55.9,64.31 56.9,70.31 58.9,2.31 57.9,4.3 57.9,8.3 58.9,10.3 57.9,12.3 58.9,14.3 57.9,16.3 58.9,18.3 57.9,20.3 58.9,22.3 57.9,24.3 57.9,32.3 58.9,34.3 57.9,36.3 58.9,38.3 57.9,40.3 58.9,42.3 58.9,54.3 58.9,58.3 57.9,72.31 60.9,2.31 60.9,6.3 59.9,8.3 60.9,10.3 59.9,12.3 60.9,14.3 59.9,16.3 60.9,18.3 59.9,20.3 60.9,22.3 59.9,24.3 60.9,26.3 60.9,66.31 60.9,70.31 59.9,72.31 62.9,2.31 61.9,4.3 62.9,6.3 61.9,8.3 62.9,10.3 61.9,12.3 62.9,14.3 61.9,16.3 62.9,18.3 61.9,20.3 62.9,22.3 61.9,24.3 62.9,26.3 61.9,28.3 62.9,30.3 61.9,32.3 62.9,34.3 61.9,36.3 62.9,38.3 61.9,40.3 62.9,42.3 61.9,44.3 62.9,46.3 61.9,48.3 62.9,50.3 61.9,52.3 62.9,54.3 61.9,56.3 62.9,58.3 61.9,60.3 62.9,62.3 61.9,64.31 62.9,66.31 61.9,68.31 62.9,70.31 64.9,2.31 63.9,4.3 64.9,6.3 63.9,8.3 64.9,10.3 63.9,12.3 64.9,14.3 63.9,16.3 64.9,18.3 63.9,20.3 64.9,22.3 63.9,24.3 64.9,26.3 63.9,28.3 64.9,30.3 63.9,32.3 64.9,34.3 63.9,36.3 64.9,38.3 63.9,40.3 64.9,42.3 63.9,44.3 64.9,46.3 63.9,48.3 64.9,50.3 63.9,52.3 64.9,54.3 63.9,56.3 64.9,58.3 63.9,60.3 64.9,62.3 63.9,64.31 64.9,66.31 63.9,68.31 64.9,70.31 66.9,2.31 65.9,4.3 66.9,6.3 65.9,8.3 66.9,10.3 65.9,12.3 66.9,14.3 65.9,16.3 66.9,18.3 65.9,20.3 66.9,22.3 65.9,24.3 66.9,26.3 65.9,28.3 66.9,30.3 65.9,32.3 66.9,34.3 65.9,36.3 66.9,38.3 65.9,40.3 66.9,42.3 65.9,44.3 66.9,46.3 65.9,48.3 66.9,50.3 65.9,52.3 66.9,54.3 65.9,56.3 66.9,58.3 65.9,60.3 66.9,62.3 65.9,64.31 66.9,66.31 65.9,68.31 66.9,70.31 68.9,2.31 67.9,4.3 68.9,6.3 67.9,8.3 68.9,10.3 67.9,12.3 68.9,14.3 67.9,16.3 68.9,18.3 67.9,20.3 68.9,22.3 67.9,24.3 68.9,26.3 67.9,28.3 68.9,30.3 67.9,32.3 68.9,34.3 67.9,36.3 68.9,38.3 67.9,40.3 68.9,42.3 67.9,44.3 68.9,46.3 67.9,48.3 68.9,50.3 67.9,52.3 68.9,54.3 67.9,56.3 68.9,58.3 67.9,60.3 68.9,62.3 67.9,64.31 68.9,66.31 67.9,68.31 68.9,70.31 70.9,2.31 69.9,4.3 70.9,6.3 69.9,8.3 70.9,10.3 69.9,12.3 70.9,14.3 69.9,16.3 70.9,18.3 69.9,20.3 70.9,22.3 69.9,24.3 70.9,26.3 69.9,28.3 70.9,30.3 69.9,32.3 70.9,34.3 69.9,36.3 70.9,38.3 69.9,40.3 70.9,42.3 69.9,44.3 70.9,46.3 69.9,48.3 70.9,50.3 69.9,52.3 70.9,54.3 69.9,56.3 70.9,58.3 69.9,60.3 70.9,62.3 69.9,64.31 70.9,66.31 69.9,68.31 70.9,70.31 72.9,2.31 71.9,4.3 72.9,6.3 71.9,8.3 72.9,10.3 71.9,12.3 72.9,14.3 71.9,16.3 72.9,18.3 71.9,20.3 72.9,22.3 71.9,24.3 72.9,26.3 71.9,28.3 72.9,30.3 71.9,32.3 72.9,34.3 71.9,36.3 72.9,38.3 71.9,40.3 72.9,42.3 71.9,44.3 72.9,46.3 71.9,48.3 72.9,50.3 71.9,52.3 72.9,54.3 71.9,56.3 72.9,58.3 71.9,60.3 72.9,62.3 71.9,64.31 72.9,66.31 71.9,68.31 72.9,70.31 74.9,2.31 73.9,4.3 74.9,6.3 73.9,8.3 74.9,10.3 73.9,12.3 74.9,14.3 73.9,16.3 74.9,18.3 73.9,20.3 74.9,22.3 73.9,24.3 74.9,26.3 73.9,28.3 74.9,30.3 73.9,32.3 74.9,34.3 73.9,36.3 74.9,38.3 73.9,40.3 74.9,42.3 73.9,44.3 74.9,46.3 73.9,48.3 74.9,50.3 73.9,52.3 74.9,54.3 73.9,56.3 74.9,58.3 73.9,60.3 74.9,62.3 73.9,64.31 74.9,66.31 73.9,68.31 74.9,70.31 76.9,2.31 75.9,4.3 76.9,6.3 75.9,8.3 76.9,10.3 75.9,12.3 76.9,14.3 75.9,16.3 76.9,18.3 75.9,20.3 76.9,22.3 75.9,24.3 76.9,26.3 75.9,28.3 76.9,30.3 75.9,32.3 76.9,34.3 75.9,36.3 76.9,38.3 75.9,40.3 76.9,42.3 75.9,44.3 76.9,46.3 75.9,48.3 76.9,50.3 75.9,52.3 76.9,54.3 75.9,56.3 76.9,58.3 75.9,60.3 76.9,62.3 75.9,64.31 76.9,66.31 75.9,68.31 76.9,70.31 78.9,2.31 77.9,4.3 78.9,6.3 77.9,8.3 78.9,10.3 77.9,12.3 78.9,14.3 77.9,16.3 78.9,18.3 77.9,20.3 78.9,22.3 77.9,24.3 78.9,26.3 77.9,28.3 78.9,30.3 77.9,32.3 78.9,34.3 77.9,36.3 78.9,38.3 77.9,40.3 78.9,42.3 77.9,44.3 78.9,46.3 77.9,48.3 78.9,50.3 77.9,52.3 78.9,54.3 77.9,56.3 78.9,58.3 77.9,60.3 78.9,62.3 77.9,64.31 78.9,66.31 77.9,68.31 78.9,70.31 80.9,2.31 79.9,4.3 80.9,6.3 79.9,8.3 80.9,10.3 79.9,12.3 80.9,14.3 79.9,16.3 80.9,18.3 79.9,20.3 80.9,22.3 79.9,24.3 80.9,26.3 79.9,28.3 80.9,30.3 79.9,32.3 80.9,34.3 79.9,36.3 80.9,38.3 79.9,40.3 80.9,42.3 79.9,44.3 80.9,46.3 79.9,48.3 80.9,50.3 79.9,52.3 80.9,54.3 79.9,56.3 80.9,58.3 79.9,60.3 80.9,62.3 79.9,64.31 80.9,66.31 79.9,68.31 80.9,70.31 82.9,2.31 81.9,4.3 82.9,6.3 81.9,8.3 82.9,10.3 81.9,12.3 82.9,14.3 81.9,16.3 82.9,18.3 81.9,20.3 82.9,22.3 81.9,24.3 82.9,26.3 81.9,28.3 82.9,30.3 81.9,32.3 82.9,34.3 81.9,36.3 82.9,38.3 81.9,40.3 82.9,42.3 81.9,44.3 82.9,46.3 81.9,48.3 82.9,50.3 81.9,52.3 82.9,54.3 81.9,56.3 82.9,58.3 81.9,60.3 82.9,62.3 81.9,64.31 82.9,66.31 81.9,68.31 82.9,70.31 84.9,2.31 83.9,4.3 84.9,6.3 83.9,8.3 84.9,10.3 83.9,12.3 84.9,14.3 83.9,16.3 84.9,18.3 83.9,20.3 84.9,22.3 83.9,24.3 84.9,26.3 83.9,28.3 84.9,30.3 83.9,32.3 84.9,34.3 83.9,36.3 84.9,38.3 83.9,40.3 84.9,42.3 83.9,44.3 84.9,46.3 83.9,48.3 84.9,50.3 83.9,52.3 84.9,54.3 83.9,56.3 84.9,58.3 83.9,60.3 84.9,62.3 83.9,64.31 84.9,66.31 83.9,68.31 84.9,70.31 86.9,2.31 85.9,4.3 86.9,6.3 85.9,8.3 86.9,10.3 85.9,12.3 86.9,14.3 85.9,16.3 86.9,18.3 85.9,20.3 86.9,22.3 85.9,24.3 86.9,26.3 85.9,28.3 86.9,30.3 85.9,32.3 86.9,34.3 85.9,36.3 86.9,38.3 85.9,40.3 86.9,42.3 85.9,44.3 86.9,46.3 85.9,48.3 86.9,50.3 85.9,52.3 86.9,54.3 85.9,56.3 86.9,58.3 85.9,60.3 86.9,62.3 85.9,64.31 86.9,66.31 85.9,68.31 86.9,70.31 88.9,2.31 87.9,4.3 88.9,6.3 87.9,8.3 88.9,10.3 87.9,12.3 88.9,14.3 87.9,16.3 88.9,18.3 87.9,20.3 88.9,22.3 87.9,24.3 88.9,26.3 87.9,28.3 88.9,30.3 87.9,32.3 88.9,34.3 87.9,36.3 88.9,38.3 87.9,40.3 88.9,42.3 87.9,44.3 88.9,46.3 87.9,48.3 88.9,50.3 87.9,52.3 88.9,54.3 87.9,56.3 88.9,58.3 87.9,60.3 88.9,62.3 87.9,64.31 88.9,66.31 87.9,68.31 88.9,70.31 90.9,2.31 89.9,4.3 89.9,8.3 89.9,12.3 89.9,16.3 89.9,20.3 89.9,24.3 89.9,28.3 89.9,32.3 90.9,34.3 89.9,36.3 90.9,38.3 89.9,40.3 90.9,42.3 89.9,44.3 90.9,46.3 89.9,48.3 90.9,50.3 89.9,52.3 90.9,54.3 89.9,56.3 90.9,58.3 89.9,60.3 90.9,62.3 89.9,64.31 90.9,66.31 89.9,68.31 90.9,70.31 92.9,2.31 92.9,10.3 92.9,14.3 92.9,18.3 92.9,22.3 92.9,26.3 92.9,30.3 91.9,36.3 92.9,38.3 91.9,40.3 92.9,42.3 91.9,44.3 92.9,46.3 91.9,48.3 92.9,50.3 91.9,52.3 92.9,54.3 91.9,56.3 92.9,58.3 91.9,60.3 92.9,62.3 91.9,64.31 92.9,66.31 91.9,72.31 94.9,2.31 94.9,10.3 93.9,12.3 94.9,14.3 93.9,16.3 94.9,18.3 93.9,20.3 94.9,22.3 93.9,24.3 94.9,26.3 93.9,28.3 94.9,30.3 93.9,32.3 93.9,44.3 93.9,48.3 93.9,52.3 93.9,56.3 93.9,60.3 93.9,64.31 93.9,72.31 96.9,2.31 95.9,8.3 95.9,12.3 95.9,16.3 95.9,20.3 95.9,24.3 95.9,28.3 95.9,32.3 96.9,42.3 95.9,44.3 96.9,46.3 95.9,48.3 96.9,50.3 95.9,52.3 96.9,54.3 95.9,56.3 96.9,58.3 95.9,60.3 96.9,62.3 95.9,64.31 96.9,66.31 95.9,72.31 98.9,2.31 97.9,4.3 98.9,6.3 97.9,8.3 98.9,10.3 97.9,12.3 98.9,14.3 97.9,16.3 98.9,18.3 97.9,20.3 98.9,22.3 97.9,24.3 98.9,26.3 97.9,28.3 98.9,30.3 97.9,32.3 98.9,34.3 97.9,36.3 98.9,38.3 97.9,40.3 98.9,42.3 97.9,44.3 98.9,46.3 97.9,48.3 98.9,50.3 97.9,52.3 98.9,54.3 97.9,56.3 98.9,58.3 97.9,60.3 98.9,62.3 97.9,64.31 98.9,66.31 97.9,68.31 98.9,70.31 97.9,72.31
  pour Top: 0,0 100,0 100,75 0,75
  pour Bottom: 0,0 100,0 100,75 0,75
  pour Bottom: 0,0 100,0 100,75 0,75
HX711CLK  (via drill 0.35)
  Top 0.203: v16,58.59 16.09,58.5 16.09,57.34 IC1.11 | v30.32,58.59 32.09,58.59 37.96,64.45 41.78,64.45 43.2,63.03 46.76,63.03 47.83,61.96 47.83,58.32 46.05,56.54 U1.15
  Bottom 0.203: v30.32,58.59 v16,58.59
HX711DAT  (via drill 0.35)
  Top 0.203: v20.54,56.01 18.4,56.01 17.42,56.98 17.42,57.25 IC1.12 | v29.52,57.87 32.36,57.87 v34.76,60.27
  Bottom 0.203: v20.54,56.01 27.65,56.01 v29.52,57.87 | v34.76,60.27 50.14,60.27 53.87,56.54 U1.14
IC_1  (via drill 0.35)
  Top 0.203: v27.2,44.36 26.05,45.52 18.22,45.52 15.91,43.2 14.49,43.2 U6.7
  Bottom 0.203: v27.2,44.36 30.32,41.25 40.98,41.25 45.96,36.27 U1.23
IC_2  (via drill 0.35)
  Top 0.203: v18.22,34.05 14.49,34.05 U5.7 | v36.63,28.27 36.8,28.27 37.16,28.63 40.98,28.63 45.96,33.6 U1.24
  Bottom 0.203: v18.22,34.05 20,34.05 26.05,28 29.34,28 29.87,28.54 34.67,28.54 34.94,28.27 v36.63,28.27
IC_3  (via drill 0.35)
  Top 0.203: v16,25.07 14.49,25.07 U2.7 | v40.45,21.78 46.23,27.56 46.41,27.56 47.03,28.18 47.03,30.05 46.05,31.03 U1.25
  Bottom 0.203: v16,25.07 31.74,25.07 35.03,21.78 v40.45,21.78
IC_4
  Top 0.203: U7.7 14.49,16.09 21.69,16.09 28.63,9.16 29.43,9.16 29.6,9.34 29.6,12.18 33.96,16.54 41.43,16.54 48.54,23.65 48.54,29.96 46.41,32.09 45.7,32.09 45.07,31.47 45.07,29.52 45.96,28.63 U1.26
IC_5
  Top 0.203: R17.1 11.65,55.03 11.65,54.59 14.05,52.18 14.4,52.18 U4.7
LCD_I2C_SCL
  Bottom 0.203: J3.2 37.96,29.96 44.36,23.56 45.96,23.56 U1.28 46.14,23.47 46.14,18.49 61.61,3.02 90.68,3.02 91.83,4.18 91.83,5.6 96.81,10.58 96.81,36.63 95.03,38.41 95.03,38.76 SV4.3
LCD_I2C_SDA
  Bottom 0.203: U1.27 46.05,25.96 46.05,24.8 47.12,23.74 47.12,18.05 61.78,3.38 90.5,3.38 91.48,4.36 91.48,32.72 94.94,36.18 SV4.2
N$1  (via drill 0.35)
  Top 0.203: v26.58,26.23 28,27.65 C29.1 | v50.49,68.45 50.49,67.74 50.32,67.56 50.32,65.61 50.14,65.43 48.01,65.43 47.21,66.23 47.21,66.59 U$1.P$4
  Bottom 0.203: v26.58,26.23 18.49,26.23 11.73,32.98 11.73,72.54 12.98,73.79 45.52,73.79 50.49,68.81 v50.49,68.45
N$2
  Top 0.203: Y1.4 25.43,30.4 20.71,30.4 C37.2
N$3
  Top 0.203: Y1.2 26.67,32 26.23,31.56 26.23,31.47 26.05,31.29 22.23,31.29 20.71,32.8 C38.2
N$4
  Top 0.203: C1.1 17.07,23.82 14.49,23.82 U2.6
N$5
  Top 0.203: C3.1 17.07,28.89 17.07,30.67 14.94,32.8 14.49,32.8 U5.6
N$7
  Top 0.203: C40.2 26.31,35.74 29.52,35.74 30.4,36.63 38.85,36.63 43.47,41.25 45.96,41.25 U1.21
N$8
  Top 0.203: C31.1 56.63,57.25 56.1,57.25 53.78,54.94 52.54,54.94 49.96,52.36 49.96,47.47 46.32,43.83 46.05,43.83 U1.20
N$9  (1 unrouted)
  Top 2.54: INPUT5.2 6.22,52.73 6.29,52.79 8.91,52.79 U4.1
N$10  (via drill 0.35)  (1 unrouted)
  Top 2.54: v7.4,50.1 9.02,50.1 9.46,49.66 U4.4
  Bottom 2.54: v7.4,50.1 4.13,50.1 INPUT5.1
N$11
  Top 0.203: C44.1 15.11,47.56 15.11,48.63 15.73,49.25 15.73,49.96 14.85,50.85 14.49,50.85 U4.6
N$12  (via drill 0.35)  (1 unrouted)
  Top 2.54: v6.31,26.4 9.51,26.4 U2.1
  Bottom 2.54: v6.31,26.4 4.62,26.4 4,25.78 INPUT2.2
N$13  (1 unrouted)
  Top 2.54: U2.4 9.51,22.67 4.53,22.67 4,23.2 INPUT2.1
N$14
  Top 0.203: C5.1 20.62,28.09 20.62,28.98 19.82,29.78 19.82,36.89 14.94,41.78 14.49,41.78 U6.6
N$17  (via drill 0.35)  (1 unrouted)
  Top 2.54: v6.31,35.38 9.51,35.38 U5.1
  Bottom 2.54: v6.31,35.38 4.62,35.38 4,34.76 INPUT3.2
N$18  (1 unrouted)
  Top 2.54: U5.4 9.51,31.65 4.53,31.65 4,32.18 INPUT3.1
N$20  (via drill 0.35)  (1 unrouted)
  Top 2.54: v6.31,17.34 9.51,17.34 U7.1
  Bottom 2.54: v6.31,17.34 4.53,17.34 4,16.8 INPUT1.2
N$21  (1 unrouted)
  Top 2.54: U7.4 9.51,13.6 4.62,13.6 INPUT1.1
N$22  (via drill 0.35)
  Top 0.203: v57.7,66.23 58.23,65.7 58.23,65.25 C14.1 | v49.25,16.98 45.16,16.98 29.69,1.51 28.18,1.51 14.85,14.85 14.49,14.85 U7.6
  Bottom 0.203: v57.7,66.23 57.87,66.23 60.54,63.56 60.54,28.27 v49.25,16.98
N$23
  Top 0.203: 13.47,51.52 13.51,51.56 15.56,51.56 16.71,52.72 16.71,60.54 14.85,62.41 14.85,62.67 IC1.7 | R16.2 10.05,47.56 10.05,47.9 10.05,47.96 11.05,48.96 11.05,49.1 13.47,51.52 | 13.47,51.52 13.16,51.83 13.16,52.01 9.78,55.38 9.78,62.23 9.42,62.59 9.42,68.1 10.85,69.52 13.6,69.52 14.94,68.19 15.2,68.19 C27.1
N$24
  Top 0.203: R17.2 11.65,56.72 12.09,56.72 12.98,55.83 14.94,55.83 15.47,56.36 15.47,58.14 13.6,60.01 13.6,62.67 IC1.8 13.51,62.76 13.51,63.83 12.71,64.63 12.09,64.63 10.85,65.88 10.85,68.99 11.02,69.16 12.18,69.16 13.16,68.19 13.51,68.19 C27.2
N$25
  Top 0.203: Q1.1 29.07,52.98 29.07,53.52 27.2,55.38 27.2,56.45 21.25,62.41 21.25,62.67 IC1.2
N$26
  Top 0.203: C25.2 11.65,66.5 11.65,66.23 14.05,63.83 15.29,63.83 16.09,63.03 16.09,62.76 IC1.6
N$27
  Top 0.203: C23.1 19.38,65.16 20.89,65.16 R4.2 20.98,65.25 21.96,66.23 23.47,66.23 | 23.47,66.23 C26.1 | Q1.3 26.85,53.96 26.85,56.27 23.29,59.83 22.58,59.83 19.91,62.5 19.91,62.67 IC1.3 19.91,62.76 19.91,63.03 20.71,63.83 22.76,63.83 23.47,64.54 23.47,66.23
N$29
  Top 0.203: R19.2 8.8,59.21 4,59.21 INPUT6.1
N$30  (via drill 0.35)
  Top 0.203: v33.43,35.65 33.43,29.78 37.52,25.69 37.52,17.87 J1.2
  Bottom 0.203: v33.43,35.65 33.07,35.65 31.11,37.6 30.32,37.6 J3.16
N$32
  Top 0.203: J1.3 36.45,17.87 36.45,26.23 31.29,31.38 31.29,34.14 30.32,35.12 J3.17
N$33
  Top 0.203: J1.5 34.23,17.87 34.23,26.05 30.32,29.96 J3.19
N$34
  Top 0.203: R3.2 14.58,64.72 15.65,64.72 16.71,63.65 16.71,61.87 16.98,61.61 17.78,61.61 18.58,62.41 18.58,62.67 IC1.4 18.67,62.76 18.67,63.03 19.82,64.19 21.43,64.19 22.4,65.16 22.58,65.16 R4.1
N$35
  Top 0.203: J1.7 32,17.87 32,24.36 29.25,27.11 29.25,31.56 30.23,32.54 J3.18
N$36
  Top 0.203: J2.3 51.92,70.14 51.92,67.56 51.03,66.67 U$1.P$1
N$37
  Top 0.203: R19.1 10.58,59.21 12.18,57.61 12.27,57.61 12.89,56.98 12.89,56.45 13.16,56.19 13.96,56.19 14.76,56.98 14.76,57.25 IC1.10 14.76,57.34 14.76,57.96 12,60.72 12,63.83 C24.1
N$38
  Top 0.203: C30.2 21.51,47.38 24.62,47.38 29.6,52.36 33.34,52.36 38.49,57.52 44.27,57.52 47.12,60.36 47.12,60.98 U$1.P$8
N$39
  Top 0.203: R18.2 8.8,61.7 4,61.7 INPUT6.2
N$40
  Top 0.203: C24.2 10.31,63.83 10.49,63.65 10.49,61.78 R18.1 10.58,61.61 13.51,58.67 13.51,57.34 IC1.9
N$42  (via drill 0.35)
  Top 0.203: v47.3,71.03 47.74,71.48 52.01,71.48 52.63,70.85 52.63,70.23 J2.2 | v49.61,68.01 49.61,66.76 49.7,66.67 U$1.P$2
  Bottom 0.203: v47.3,71.03 47.3,70.32 v49.61,68.01
N$44
  Top 0.203: FB1.2 54.23,68.28 54.23,68.99 53.34,69.88 53.34,70.14 J2.1
N$45  (via drill 0.35)
  Top 0.203: v54.59,66.32 54.59,65.25 R20.2 | v57.43,69.16 57.43,68.99 58.23,68.19 R21.1 | v35.29,22.49 35.29,17.87 J1.4 35.38,17.78 35.38,17.51 36.01,16.89 40.8,16.89 v47.83,23.91
  Bottom 0.203: v57.43,69.16 54.98,66.72 | 54.98,66.72 v54.59,66.32 | v35.29,22.49 30.32,27.47 J3.20 | 54.98,66.72 59.83,61.87 59.83,33.07 53.78,27.03 50.94,27.03 v47.83,23.91
N$50  (via drill 0.35)  (1 unrouted)
  Top 2.54: v6.31,44.36 9.51,44.36 U6.1
  Bottom 2.54: v6.31,44.36 4.62,44.36 INPUT4.2
N$51  (1 unrouted)
  Top 2.54: U6.4 9.51,40.63 4.53,40.63 4,41.16 INPUT4.1
RESET  (via drill 0.35)
  Top 0.203: v59.83,62.85 59.83,61.43 58.76,60.36 57.52,60.36 56.72,61.16 56.45,61.16 R1.1 | v20.8,41.43 20.8,35.12 C39.2 20.8,35.03 20.98,34.85 v20.98,34.05 | v26.31,28.71 26.31,27.74 C29.2 | v22.14,59.3 22.76,59.3 24.54,57.52 24.54,51.03 23.56,50.05 SV1.5 | v35.2,28.98 38.32,28.98 44.01,34.67 46.41,34.67 53.52,27.56 53.78,27.56 54.94,26.4 54.94,25.6 53.96,24.62 53.96,23.56 U1.1
  Bottom 0.203: v59.83,62.85 59.83,62.41 60.19,62.05 60.19,29.78 53.96,23.56 U1.1 | v20.8,41.43 20.8,47.3 23.47,49.96 SV1.5 | v20.98,34.05 v26.31,28.71 26.4,28.71 26.67,28.98 v35.2,28.98 | v22.14,59.3 13.07,68.36 13.07,71.92 S1.1
SDCARD_SPI_MISO
  Bottom 0.203: U1.18 52.63,48.9 53.87,47.65 54.59,47.65 55.83,46.41 55.83,32.8 55.38,32.36 38.14,32.36 37.96,32.54 J3.3 37.87,32.63 31.38,39.12 22.14,39.12 20.09,41.16 20.09,47.38 18.49,48.98 18.49,49.96 SV1.1
SDCARD_SPI_MOSI
  Top 0.203: J3.4 37.96,35.2 42.49,39.74 45.87,39.74 47.03,40.89 47.03,41.6 46.41,42.23 46.23,42.23 45.07,43.38 45.07,49.25 45.96,50.14 45.96,51.38 U1.17 46.05,51.47 47.03,52.45 47.03,54.32 46.41,54.94 45.61,54.94 42.67,52.01 30.49,52.01 24.98,46.49 19.2,46.49 18.94,46.76 18.94,47.92 19.47,48.45 19.47,49.96 20.89,51.38 20.89,52.45 SV1.4
SDCARD_SPI_SCK
  Bottom 0.203: U1.19 45.96,46.41 28.54,46.41 23.91,51.03 21.96,51.03 20.98,50.05 SV1.3
SDCARD_SPI_SS
  Top 0.203: U1.16 45.96,53.96 45.96,52.72 38.94,45.7 38.94,38.67 37.96,37.69 J3.5
SPEAKER_PWM
  Bottom 0.203: U1.5 53.87,33.69 53.87,34.94 47.03,41.78 47.03,46.76 45.87,47.92 39.29,47.92 37.87,49.34 37.52,49.34 31.03,55.83 31.03,59.21 28.36,61.87 SP1.+
SW1  (via drill 0.35)
  Top 0.203: C8.2 43.83,63.92 42.76,64.99 42.76,66.67 R5.1 42.67,66.76 42.49,66.76 37.34,71.92 36.01,71.92 S3.1 | v54.67,62.59 54.67,61.52 55.83,60.36 56.81,60.36 58.23,58.94 58.23,52.45 57.34,51.56 56.19,51.56 56.01,51.38 56.01,51.3 53.96,49.25 U1.11
  Bottom 0.203: v54.67,62.59 51.3,62.59 43.12,70.76 37.16,70.76 36.01,71.92 S3.1
SW2  (via drill 0.35)
  Top 0.203: R2.1 40.72,61.87 39.29,60.45 39.29,58.59 39.74,58.14 41.78,58.14 42.49,58.85 42.76,58.85 C7.2 42.94,58.94 43.65,58.23 v44.01,58.23 | v51.83,52.09 52.45,51.47 53.87,51.47 U1.12
  Bottom 0.203: v51.83,52.09 45.7,58.23 v44.01,58.23 43.92,58.23 42.58,59.56 33.52,59.56 24.54,68.54 24.54,71.92 S2.1
UART_RX  (via drill 0.35)
  Top 0.203: v49.25,48.18 48.45,48.98 48.45,60.98 U$1.P$7 | v55.12,33.07 55.12,26.76 55.3,26.58 55.3,23.02 54.76,22.49 53.16,22.49 52.98,22.67 52.98,25.07 53.87,25.96 U1.2
  Bottom 0.203: v49.25,48.18 52.81,48.18 53.7,47.3 54.41,47.3 55.12,46.58 v55.12,33.07
URAT_TX  (via drill 0.35)
  Top 0.203: v49.25,51.74 49.25,52.18 49.7,52.63 49.7,60.98 U$1.P$6
  Bottom 0.203: v49.25,51.74 50.23,51.74 52.09,49.87 54.32,49.87 56.19,48.01 56.19,30.85 53.96,28.63 U1.3
VCC  (via drill 0.35)
  Top 0.508: v18.85,26.94 18.94,26.85 18.94,25.87 C33.1 | v18.4,44.72 24.45,44.72 24.62,44.54 U3.3
  Bottom 0.508: v18.85,26.94 18.85,32.27 16.09,35.03 16.09,42.41 v18.4,44.72

### Text on the board
bPlace: 2021/11/09 / GankenKun / Current measurement circuit / Ver1.0 / Designed it byTakuya Nagamine